# EasyEDA Pro project JP_WING_R.eprj

# Schematic Schematic1
Board Name: Board1; Create Date: 2025-08-31; Page Name: P1; Project Name: JP_WING; Schematic Name: Schematic1; Update Date: 2025-08-31; Company: EasyEDA.com; Page Size: A4; Version: V1.0
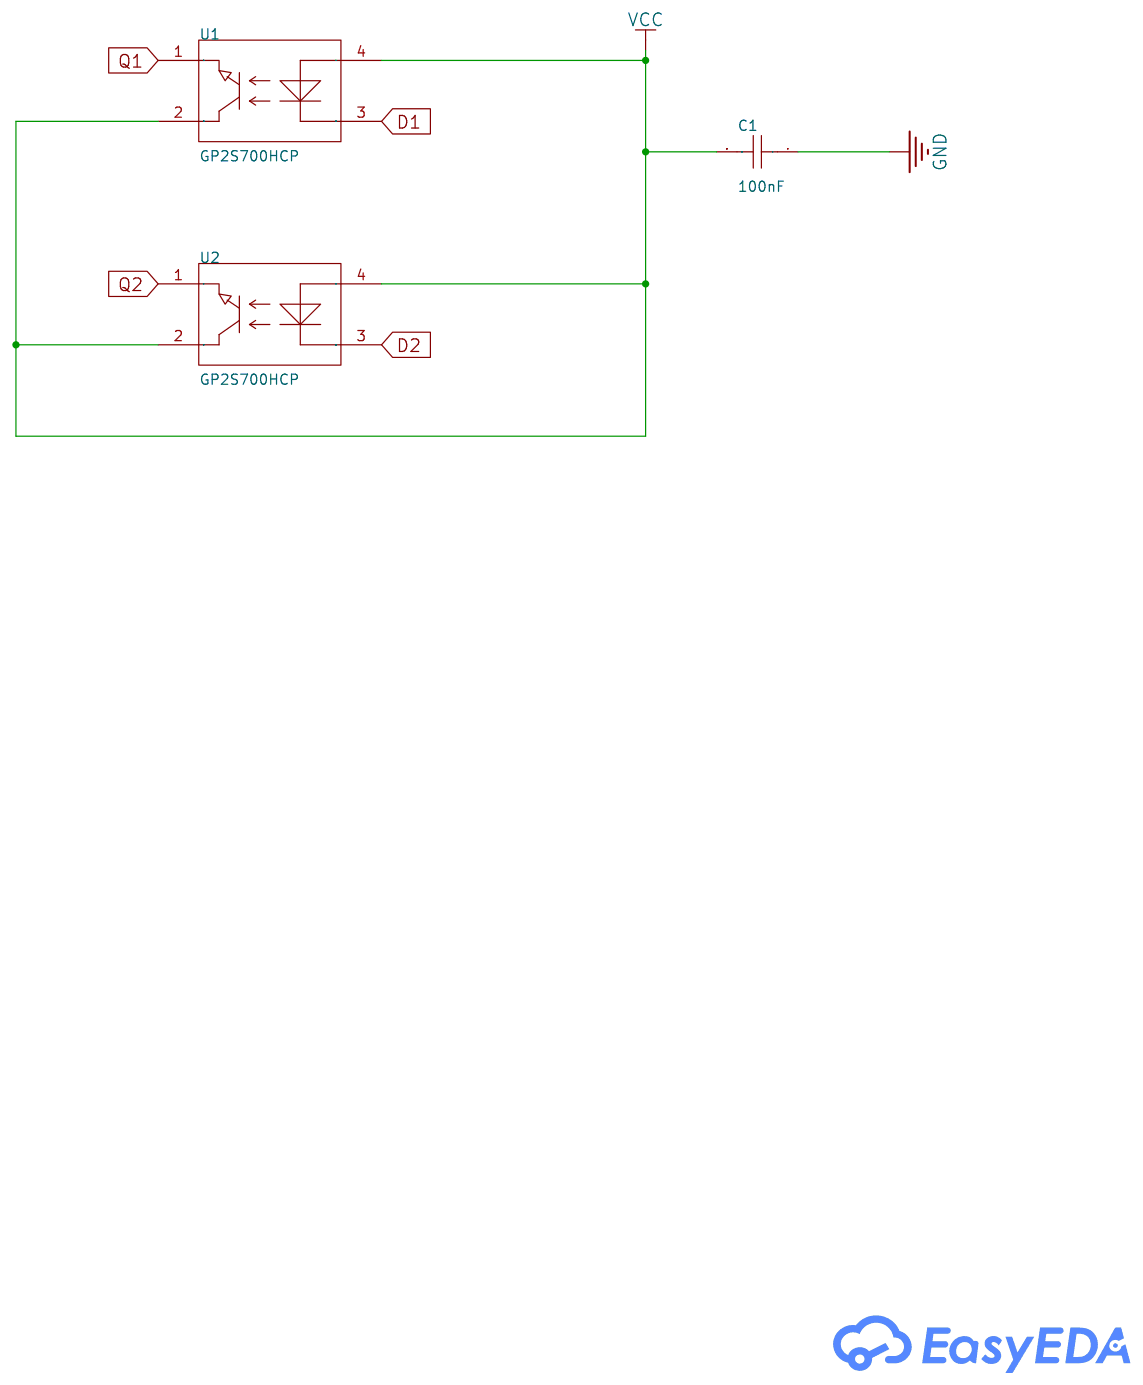
[diagram p0: schematic sheet]

## Parts
C1  100nF  [C0603]
U1  GP2S700HCP  [OPTO-SMD_GP2S700HCP]
U2  GP2S700HCP  [OPTO-SMD_GP2S700HCP]

## Library data of the parts
C1 = CAP_0603: Supplier Footprint: 0603
U1 U2 = GP2S700HCP: Sensing Distance:5.5mm Collector Current (Max):20mA; Supplier Part: C84392; Manufacturer: SHARP(夏普); Supplier Footprint: SMD-4P; JLCPCB Part Class: Extended Part; Datasheet: https://atta.szlcsc.com/upload/public/pdf/source/20180614/C84392_04826074CB7AA100700AE9A13738AF35.pdf; Supplier: LCSC; Sensing Distance: 5.5mm; Collector Current (Max): 20mA

## Nets
GND: C1.1
VCC: C1.2 U1.2 U1.4 U2.2 U2.4
D1: U1.3
D2: U2.3
Q1: U1.1
Q2: U2.1

# Board PCB1
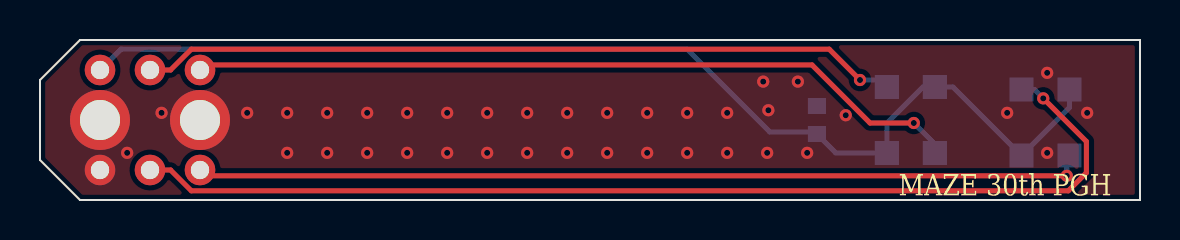
[diagram p1: board, top side]
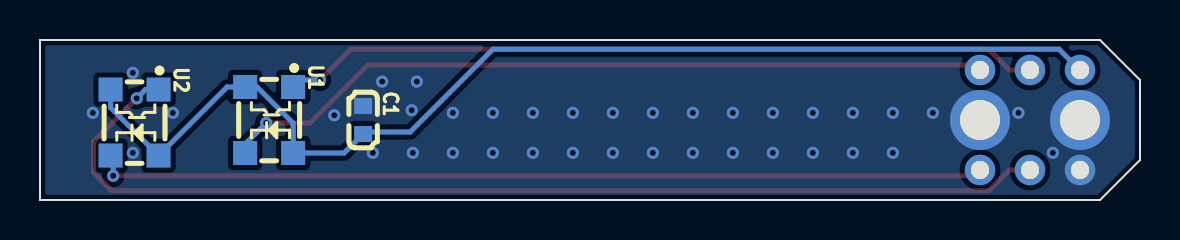
[diagram p2: board, bottom side, seen from below]

Outline 55 x 8 mm; copper layers: Top Layer, Bottom Layer. Coordinates in mm from the lower left corner of the outline.
Outline path: 0,6 0,2 2,0 55,0 55,8 2,8 0,6
Stack: Top Layer 0.035mm / Dielectric1 1.51mm FR4 er 4.5 / Bottom Layer 0.035mm

## Design rules (mm)
template: Custom Config
spacing copperThickness1oz (default): track to track 0.102, other pairs 0.152 to 0.3
spacing copperThickness2oz: track to track 0.203, other pairs 0.152 to 0.3
track width copperThickness1oz (default): min 0.127, default 0.254, max 2.54
track width copperThickness2oz: min 0.203, default 0.254, max 2.54
differential pair differentialPair (default): width min 0.127, default 0.254, max 2.54; gap min 0.152, default 0.152
via viaSize (default): diameter min 0.5, default 0.61, max 10; hole min 0.3, default 0.305, max 6.3

## Placement (name value [footprint] x y rotation side)
C1  100nF  [C0603]  38.84 4 270 bottom
NOREF  -  [Pad_e53]  3 1.5 0 top
NOREF#2  -  [Pad_e290]  8 4 0 top
NOREF#3  -  [Pad_e63]  5.5 6.5 0 top
NOREF#4  -  [Pad_e288]  3 4 0 top
NOREF#5  -  [Pad_e59]  3 6.5 0 top
NOREF#6  -  [Pad_e60]  8 6.5 0 top
NOREF#7  -  [Pad_e64]  5.5 1.5 0 top
NOREF#8  -  [Pad_e61]  8 1.5 0 top
U1  GP2S700HCP  [OPTO-SMD_GP2S700HCP]  43.54 4 270 bottom
U2  GP2S700HCP  [OPTO-SMD_GP2S700HCP]  50.27 3.87 270 bottom

## Footprints (pads in the part's own frame, mm; a bottom-side part is the same pattern mirrored in y, then rotated)
C0603
  rect 0.8x0.9 smd: 1(-0.7,0) 2(0.7,0)
OPTO-SMD_GP2S700HCP
  rect 1.2x1.2 smd: 1(-1.65,1.2) 2(-1.65,-1.2) 3(1.65,-1.2) 4(1.65,1.2)
Pad_e53
  round 1.524 hole 0.914: 1(0,0)
Pad_e59
  round 1.524 hole 0.914: 1(0,0)
Pad_e60
  round 1.524 hole 0.914: 2(0,0)
Pad_e61
  round 1.524 hole 0.914: 3(0,0)
Pad_e63
  round 1.524 hole 0.914: 1(0,0)
Pad_e64
  round 1.524 hole 0.914: 2(0,0)
Pad_e288
  round 3 hole 2: 1(0,0)
Pad_e290
  round 3 hole 2: 1(0,0)

## Nets
GND: C1.1 NOREF.1 NOREF#2.1 NOREF#4.1
VCC: C1.2 NOREF#5.1 U1.2 U1.4 U2.2 U2.4
D1: NOREF#6.2 U1.3
D2: NOREF#8.3 U2.3
Q1: NOREF#3.1 U1.1
Q2: NOREF#7.2 U2.1

## Via types
v1: diameter 0.61, hole 0.305, Top Layer to Bottom Layer, 41 vias

## Routing (per net, layer and track width the routed paths; a pad name or vN(x,y) marks a point on that pad's centre or on a via; arc(x,y) is an arc through that point)
GND:
  vias: v1(4.36,2.36) v1(6.08,4.36) v1(10.36,4.36) v1(12.36,4.36) v1(12.36,2.36) v1(14.36,4.36) v1(14.36,2.36) v1(16.36,4.36) v1(16.36,2.36) v1(18.36,4.36) v1(18.36,2.36) v1(20.36,4.36) v1(20.36,2.36) v1(22.36,4.36) v1(22.36,2.36) v1(24.36,4.36) v1(24.36,2.36) v1(26.36,4.36) v1(26.36,2.36) v1(28.36,4.36) v1(28.36,2.36) v1(30.36,4.36) v1(30.36,2.36) v1(32.36,4.36) v1(32.36,2.36) v1(34.36,4.36) v1(34.36,2.36) v1(36.16,5.92) v1(36.42,4.49) v1(36.36,2.36) v1(37.89,5.92) v1(38.36,2.36) v1(40.29,4.24) v1(48.36,4.36) v1(50.36,6.36) v1(50.36,2.36) v1(52.36,4.36)
VCC: length 56.6
  Bottom Layer w0.254: 3,6.49 4.05,7.54 32.35,7.54 36.49,3.4 38.74,3.4 C1.2 39.79,2.35 U1.4 42.34,3.84 44.15,5.65 U1.2 45.65,5.65 U2.4 51.47,4.62 U2.2
D1: length 38.9
  Top Layer w0.254: NOREF#6.2 8.25,6.75 38.6,6.75 41.5,3.85 v1(43.69,3.85)
  Bottom Layer w0.254: U1.3 44.74,2.8 v1(43.69,3.85)
D2: length 44.5
  Top Layer w0.254: v1(51.34,1.21) 8.29,1.21 NOREF#8.3
  Bottom Layer w0.254: v1(51.34,1.21) 51.34,2.09
  Bottom Layer w0.5: 51.34,2.09 U2.3
Q1: length 38.1
  Top Layer w0.254: NOREF#3.1 6.53,6.5 7.57,7.54 39.46,7.54 v1(41,6)
  Bottom Layer w0.254: U1.1 41.99,6 v1(41,6)
Q2: length 53.5
  Top Layer w0.254: v1(50.16,5.08) 52.32,2.92 52.32,1.36 51.41,0.46 7.57,0.46 6.53,1.5 NOREF#7.2
  Bottom Layer w0.254: v1(50.16,5.08) 49.72,5.52 U2.1

## Copper pours and planes (outline as drawn; the poured copper is in the pictures)
GND on Top Layer: -1.67,11.47 55.54,11.47 55.54,-0.81 -1.67,-0.81
GND on Bottom Layer: -2.14,11.89 55.54,11.89 55.54,-0.81 -2.14,-0.81

## Text on the board
Top Silkscreen Layer: MAZE 30th PGH
